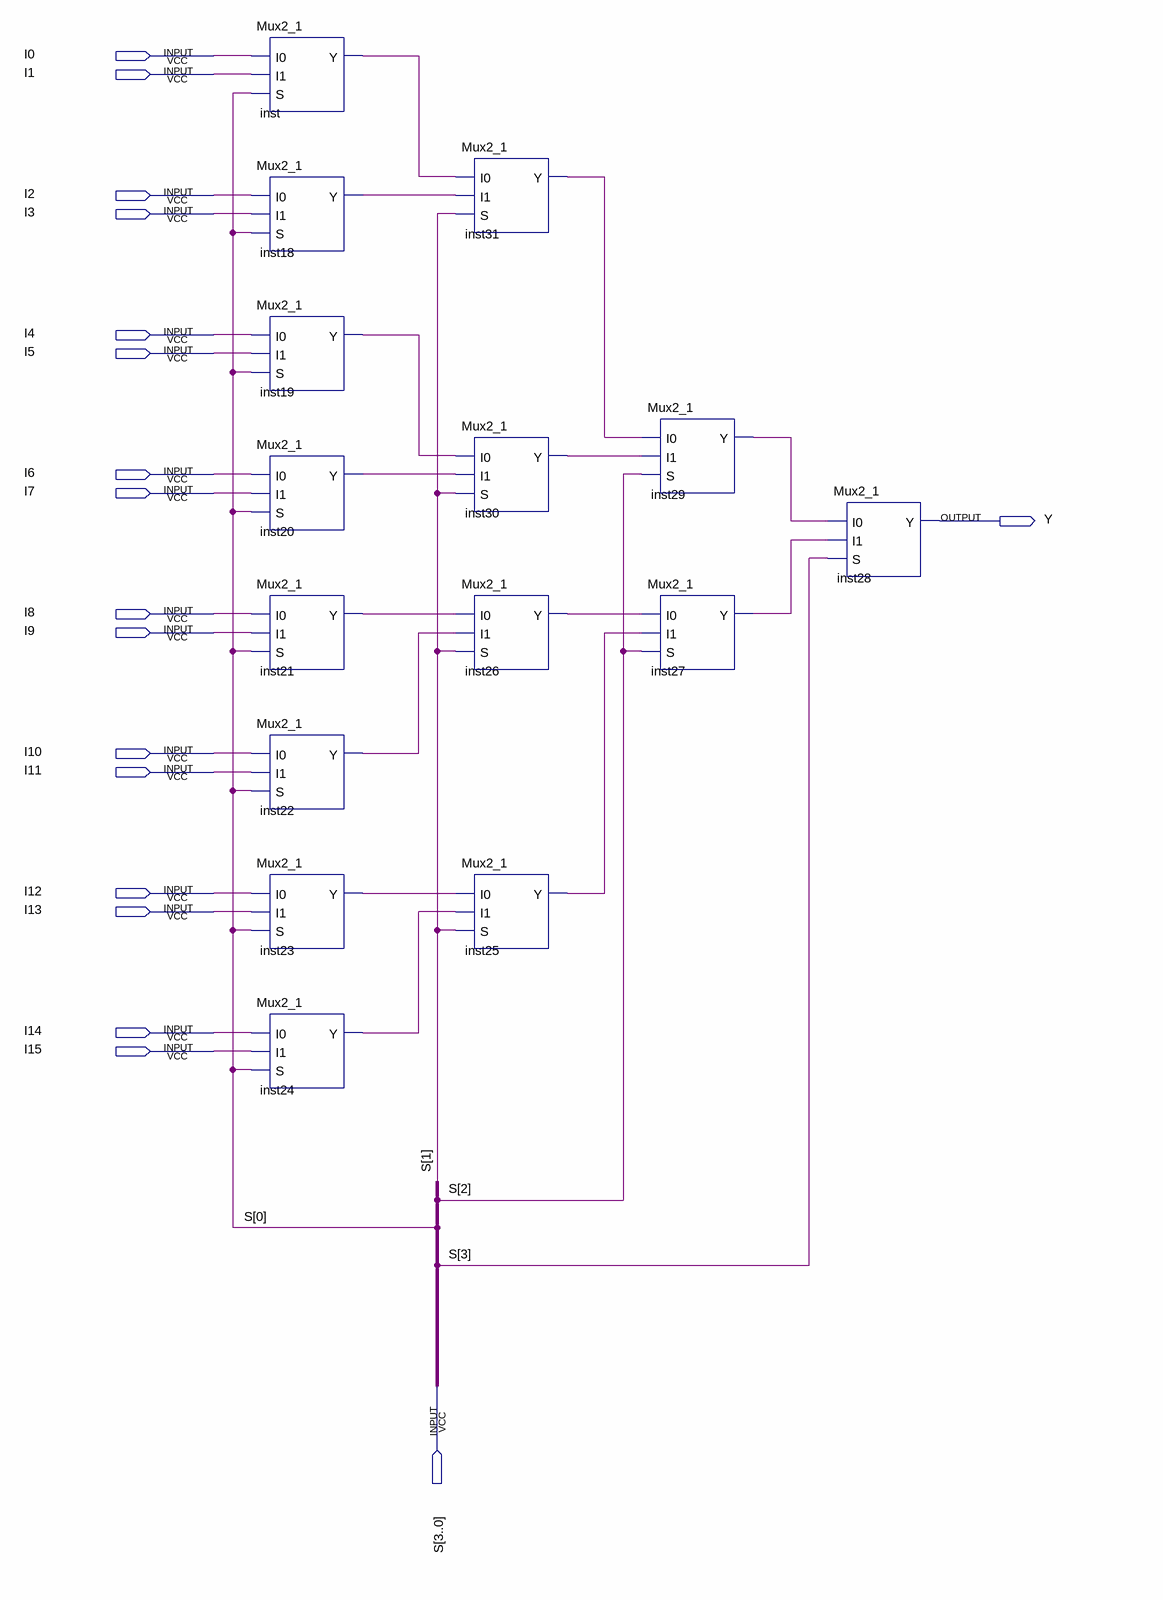
[diagram p0: schematic sheet]
// Quartus schematic Mux16_1.bdf as structural Verilog: 15 symbols, 18 pins
module Mux16_1 (
  input  I0,
  input  I1,
  input  I2,
  input  I3,
  input  I4,
  input  I5,
  input  I6,
  input  I7,
  input  I8,
  input  I9,
  input  I10,
  input  I11,
  input  I12,
  input  I13,
  input  I14,
  input  I15,
  input  [3:0] S,
  output Y
);

  wire inst18_y, inst19_y, inst20_y, inst21_y, inst22_y, inst23_y, inst24_y, inst25_y, inst26_y, inst27_y,
       inst29_y, inst30_y, inst31_y, inst_y;

  Mux2_1 inst (.I0(I0), .I1(I1), .S(S[0]), .Y(inst_y));
  Mux2_1 inst18 (.I0(I2), .I1(I3), .S(S[0]), .Y(inst18_y));
  Mux2_1 inst19 (.I0(I4), .I1(I5), .S(S[0]), .Y(inst19_y));
  Mux2_1 inst20 (.I0(I6), .I1(I7), .S(S[0]), .Y(inst20_y));
  Mux2_1 inst21 (.I0(I8), .I1(I9), .S(S[0]), .Y(inst21_y));
  Mux2_1 inst22 (.I0(I10), .I1(I11), .S(S[0]), .Y(inst22_y));
  Mux2_1 inst23 (.I0(I12), .I1(I13), .S(S[0]), .Y(inst23_y));
  Mux2_1 inst24 (.I0(I14), .I1(I15), .S(S[0]), .Y(inst24_y));
  Mux2_1 inst31 (.I0(inst_y), .I1(inst18_y), .S(S[1]), .Y(inst31_y));
  Mux2_1 inst30 (.I0(inst19_y), .I1(inst20_y), .S(S[1]), .Y(inst30_y));
  Mux2_1 inst26 (.I0(inst21_y), .I1(inst22_y), .S(S[1]), .Y(inst26_y));
  Mux2_1 inst25 (.I0(inst23_y), .I1(inst24_y), .S(S[1]), .Y(inst25_y));
  Mux2_1 inst29 (.I0(inst31_y), .I1(inst30_y), .S(S[2]), .Y(inst29_y));
  Mux2_1 inst27 (.I0(inst26_y), .I1(inst25_y), .S(S[2]), .Y(inst27_y));
  Mux2_1 inst28 (.I0(inst29_y), .I1(inst27_y), .S(S[3]), .Y(Y));
endmodule
